# EasyEDA Pro project ProPrj_transverter-front-end_2026-04-14.epro, board 1-PCB_PCB_transverter-power-board
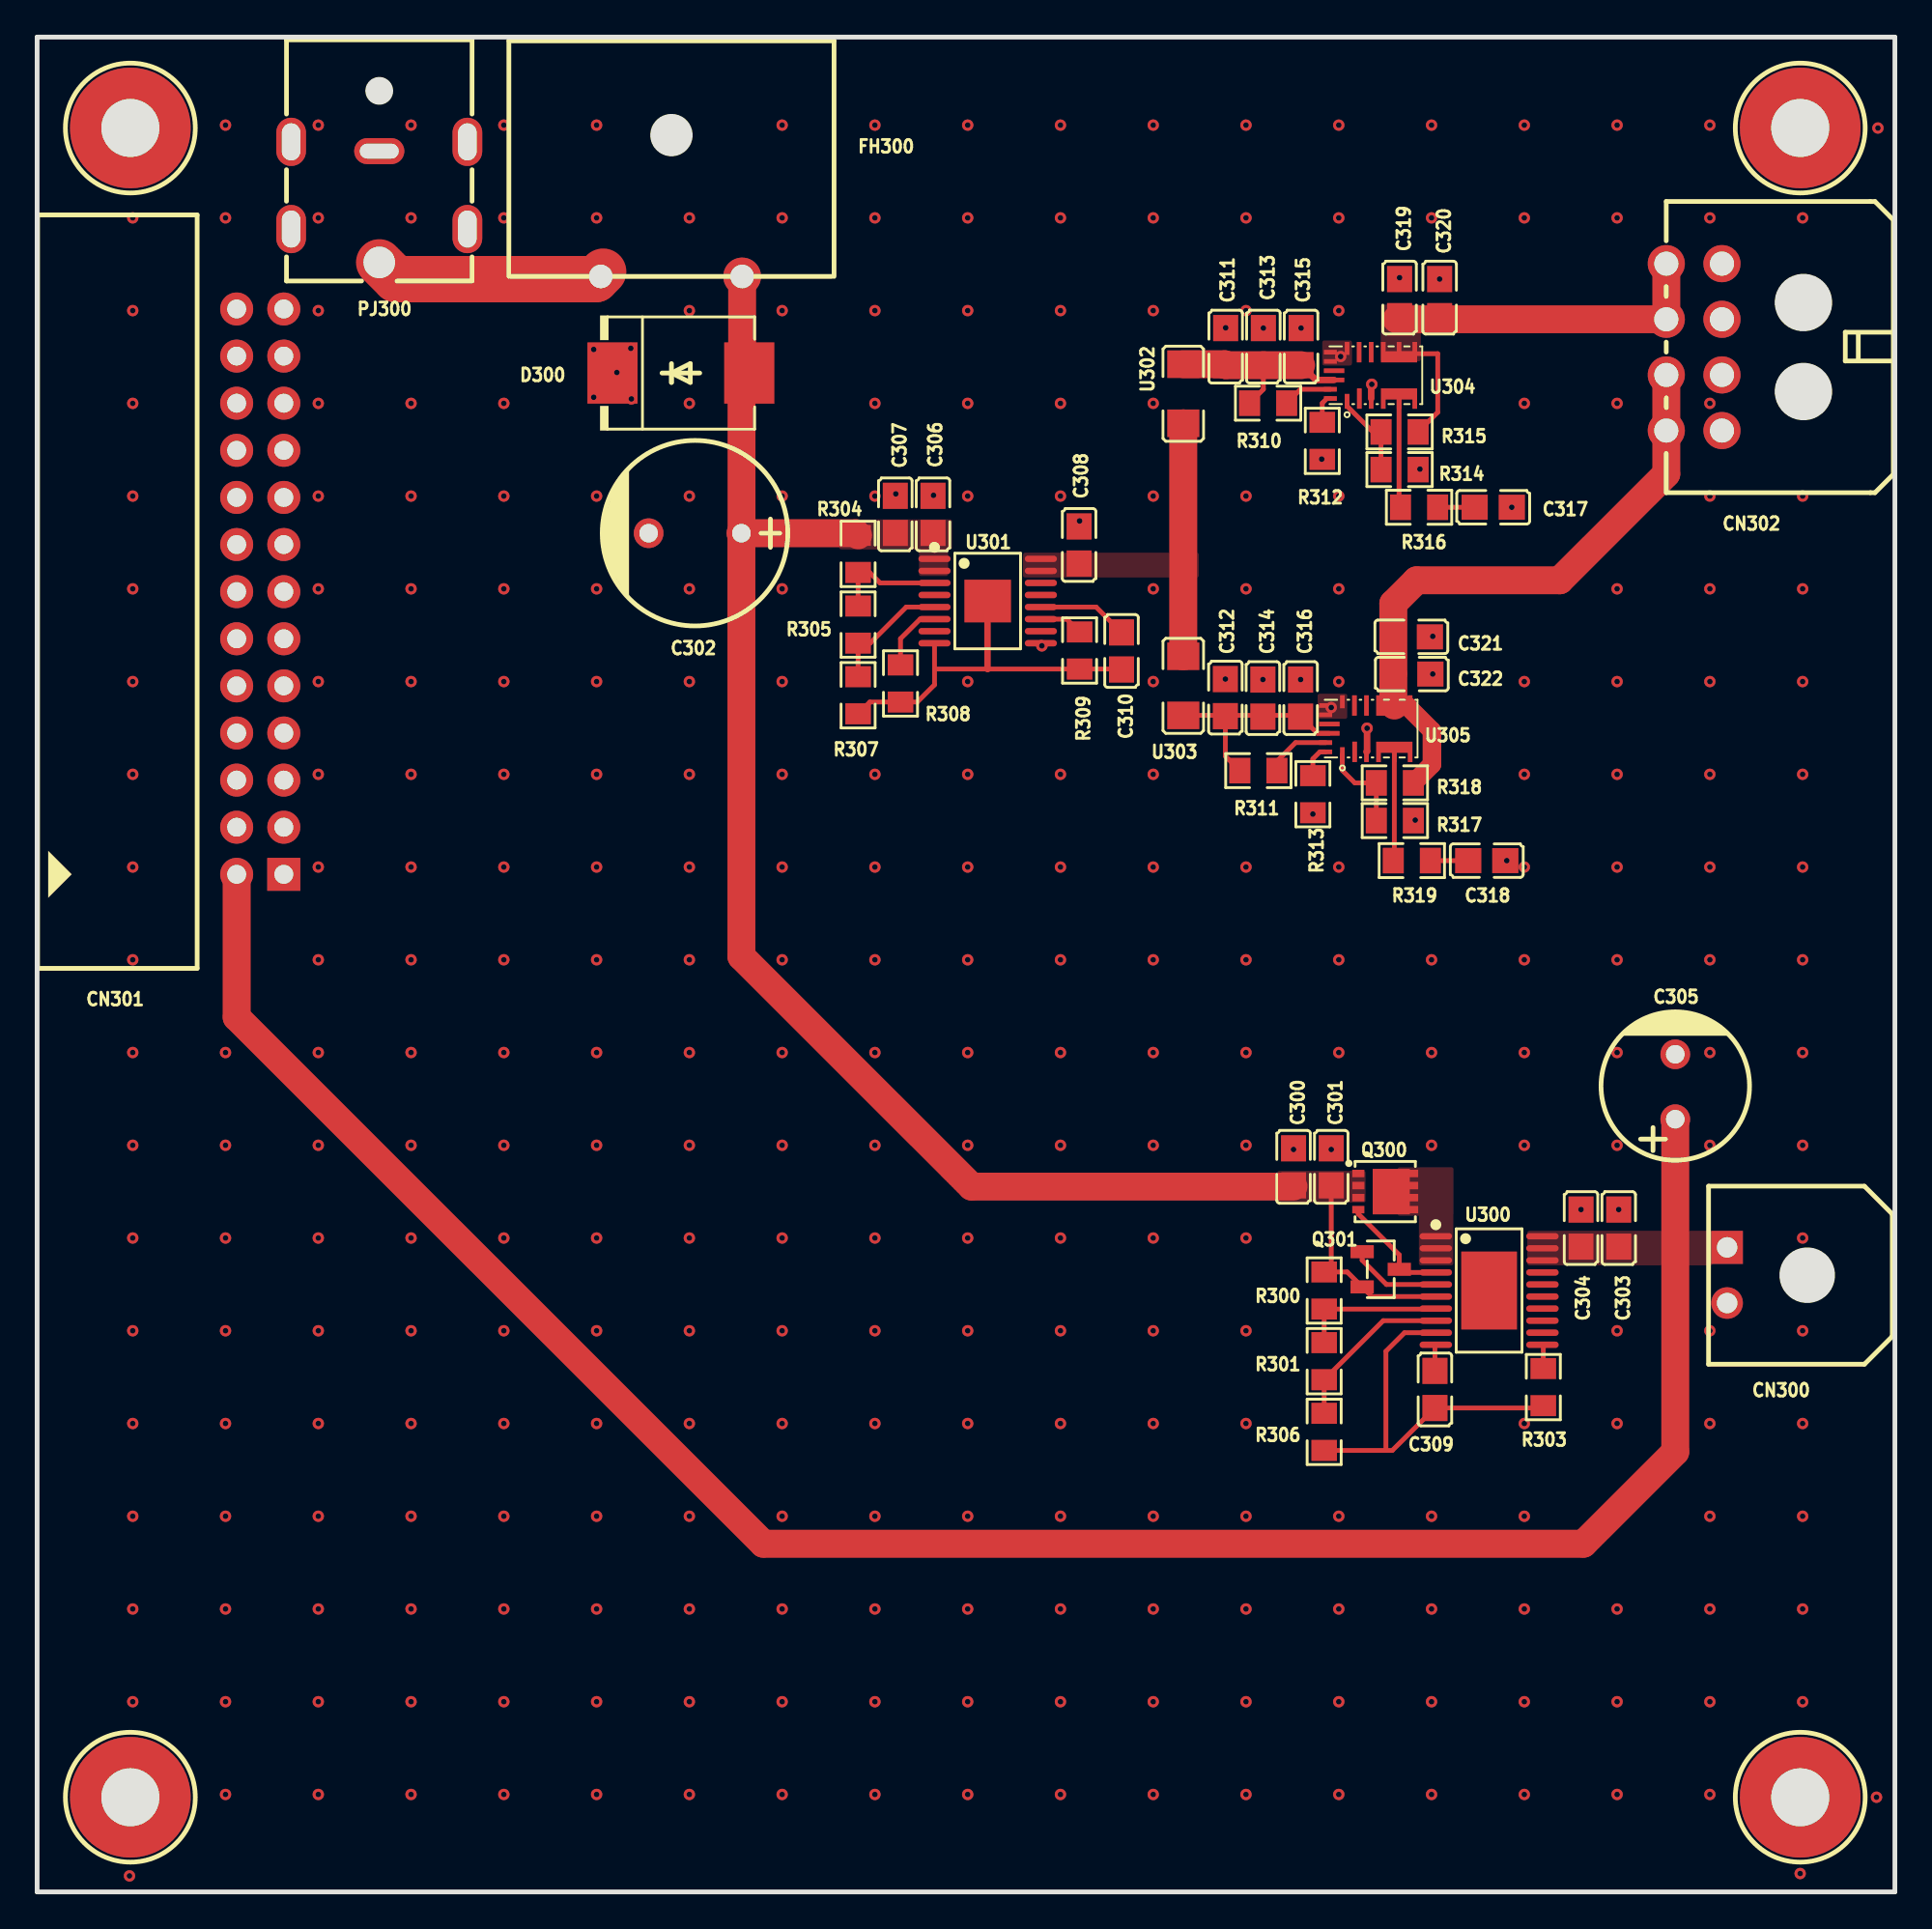
[diagram p9: board, top side]
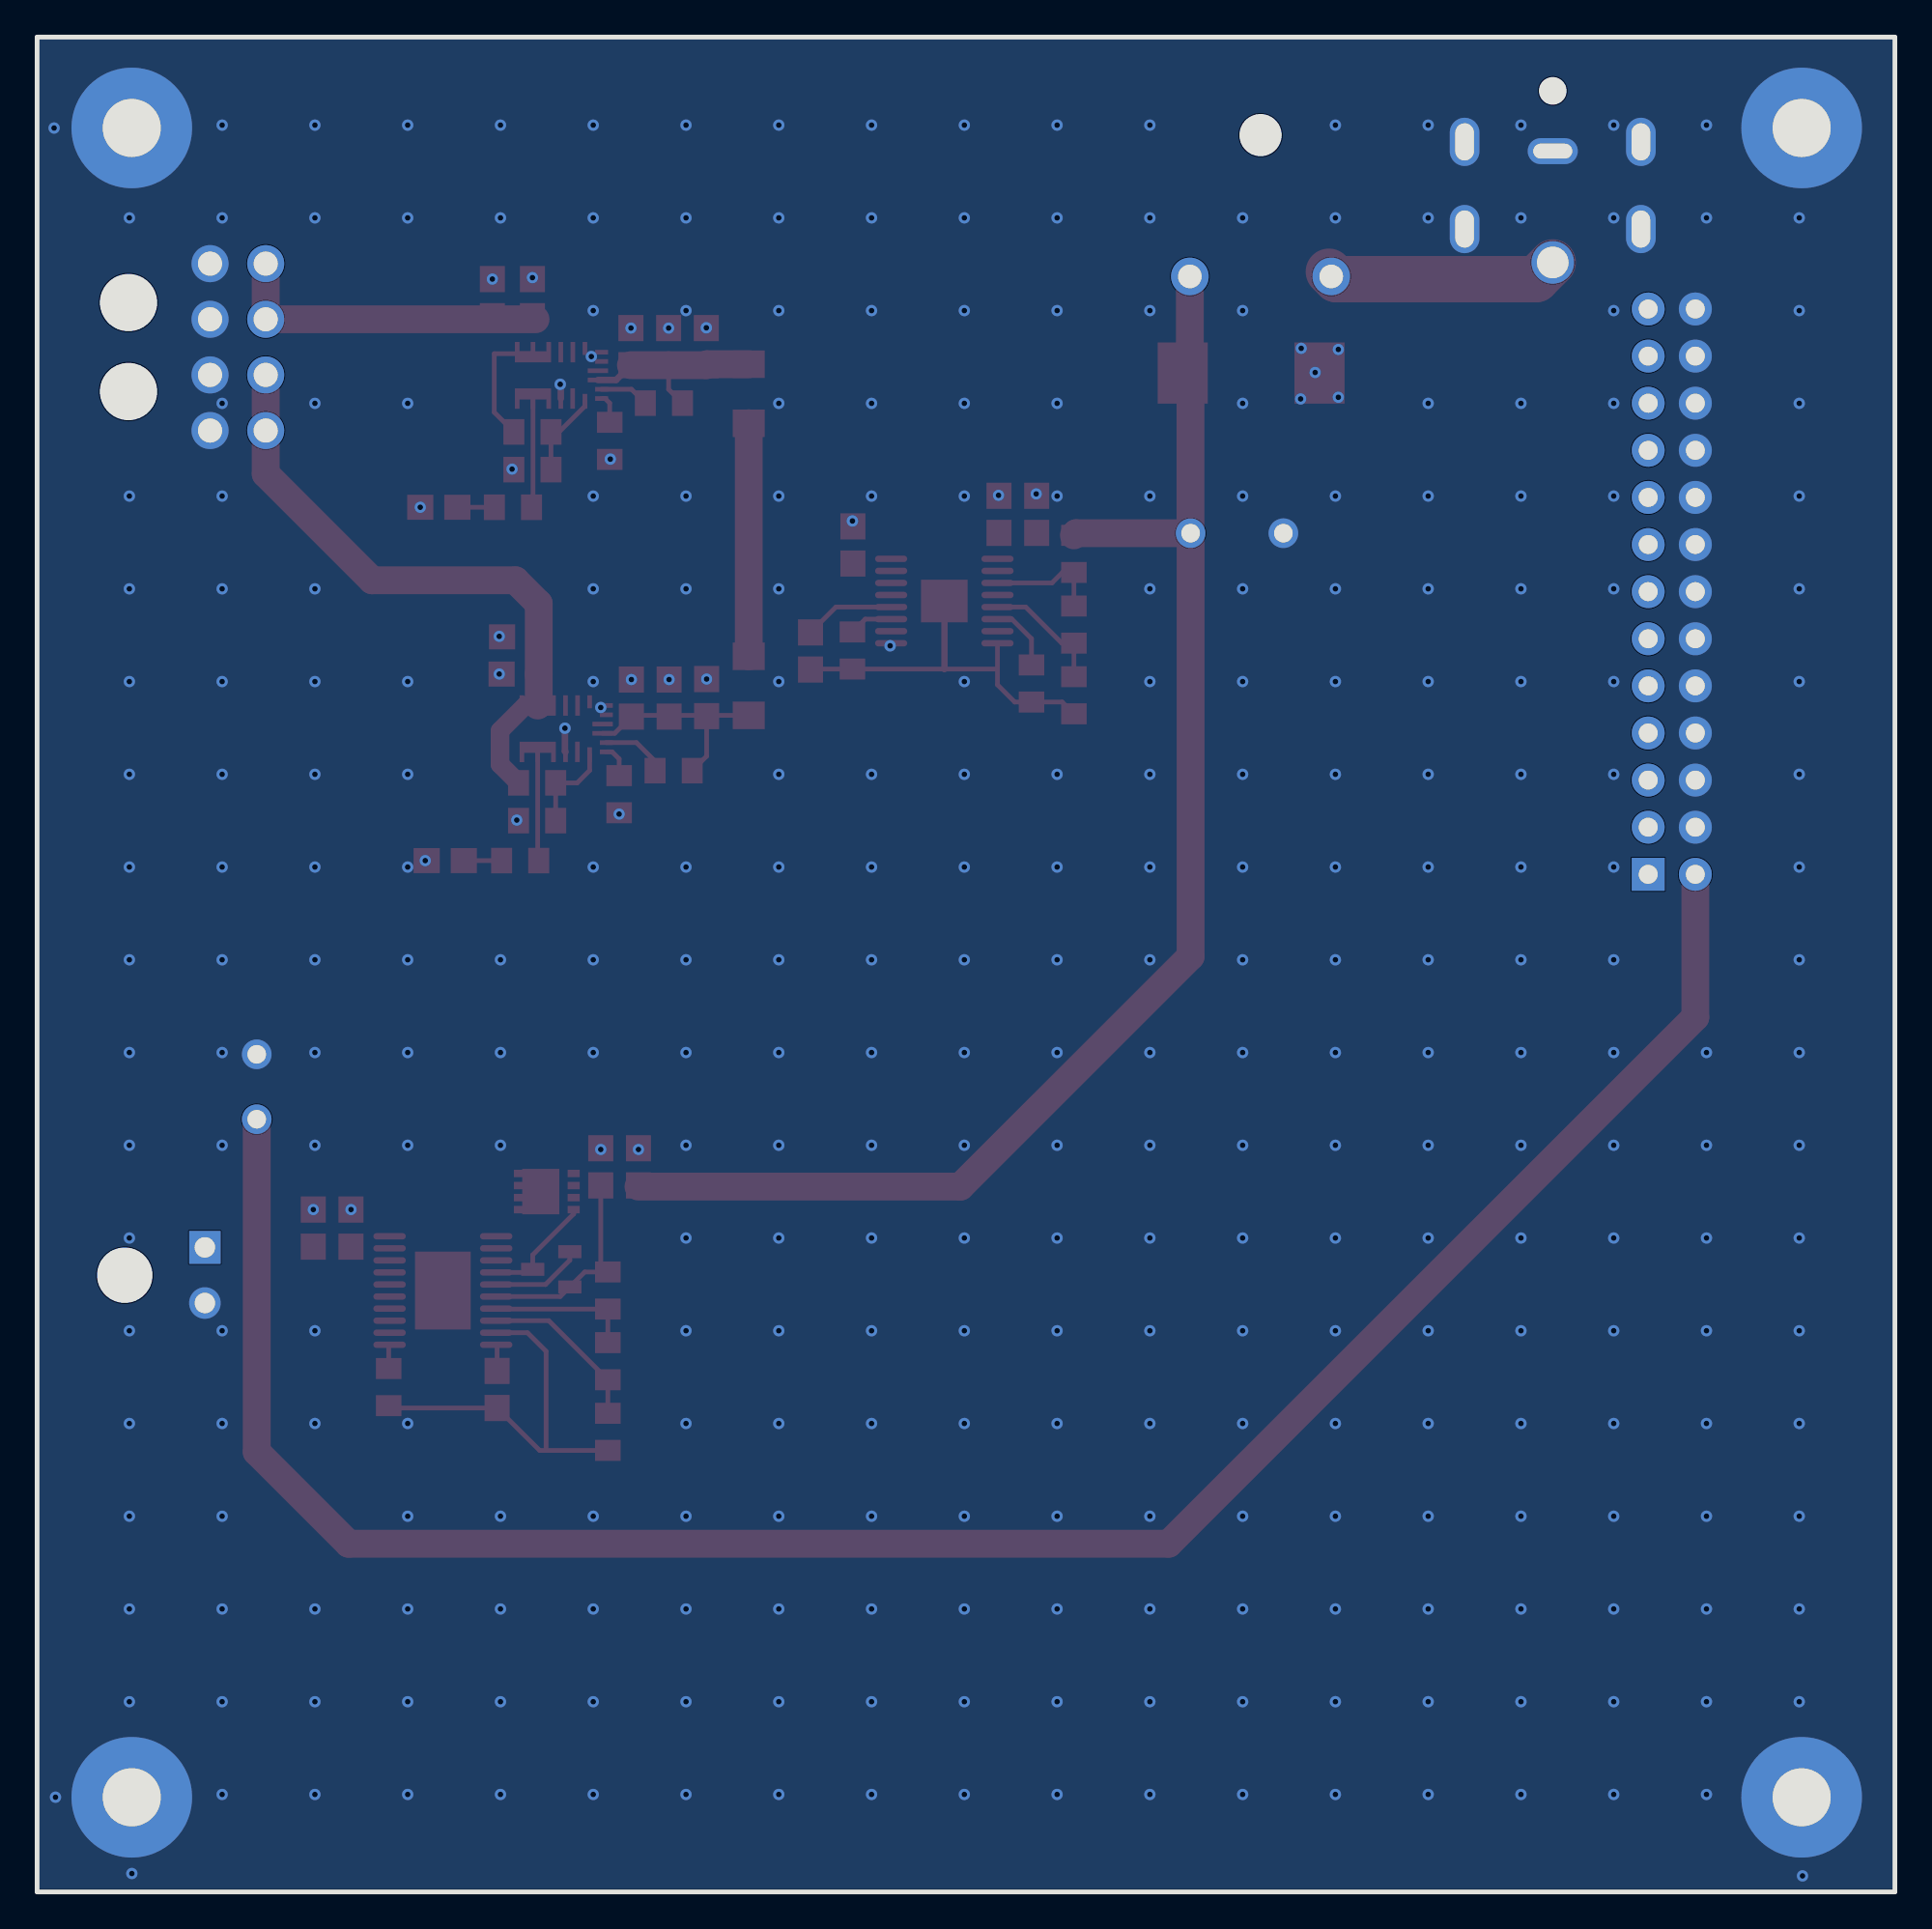
[diagram p10: board, bottom side, seen from below]

Outline 100.13 x 100 mm; copper layers: Top Layer, Bottom Layer. Coordinates in mm from the lower left corner of the outline.
Outline path: 0,100 100.13,100 100.13,0 0,0 0,100
Stack: Top Layer 0.035mm / Dielectric1 1.51mm FR4 er 4.5 / Bottom Layer 0.035mm

## Design rules (mm)
net BUCK-FEED: main_power
net PA-OUTPUT: main_power
template: User Custom Config
spacing Default (default): track to track 0.152, other pairs 0 to 0.152
spacing clean_voltage: track to track 0.152, other pairs 0.152 to 0.3
spacing control_lines: track to track 0.5, other pairs 0.152 to 0.3
spacing ground_guard: track to track 0.3, other pairs 0.152 to 0.3
spacing main_power: track to track 2, other pairs 0.152 to 0.3
spacing relay_power: track to track 1, other pairs 0.152 to 0.3
spacing RF: track to track 1, other pairs 0 to 0.65
spacing small_components: track to track 0.152, other pairs 0.152 to 0.3
spacing small_power: track to track 0.6, other pairs 0.152 to 0.3
track width Default (default): min 0.254, default 0.254, max 25.4
track width control_lines: min 0.25, default 0.25, max 0.26
track width main_power: min 1.5, default 1.5, max 3
track width relay_power: min 1, default 1, max 1.25
track width RF: min 0.157, default 0.157, max 0.157
track width small_power: min 0.5, default 0.5, max 2.54
differential pair differentialPair (default): width min 0.127, default 0.254, max 2.54; gap min 0.152, default 0.152
via Default (default): diameter min 0.61, default 0.61, max 100.025; hole min 0.305, default 0.305, max 59.995
via RF: diameter min 0.61, default 0.61, max 100.025; hole min 0.305, default 0.305, max 59.995
net $Q300_5 uses copper_pour_power_trace

## Placement (name value [footprint] x y rotation side)
C300  100nF  [C0805]  67.72 39.09 270 top
C301  1uF  [C0805]  69.75 39.09 90 top
C302  220µF  [CAP-TH_BD10.0-P5.00-D0.6-FD]  35.46 73.25 180 top
C303  100nF  [C0805]  85.24 35.79 90 top
C304  1uF  [C0805]  83.21 35.79 90 top
C305  47 µF  [CAP-TH_BD8.0-P3.50-D0.6-FD]  88.29 43.41 90 top
C306  100nF  [C0805]  48.29 74.27 90 top
C307  1uF  [C0805]  46.25 74.27 270 top
C308  1uF  [C0805]  56.16 72.62 270 top
C309  100nF  [C0805]  75.34 27.09 90 top
C310  100nF  [C0805]  58.45 66.9 90 top
C311  10uF  [C0805]  64.06 83.31 270 top
C312  10uF  [C0805]  64.04 64.39 270 top
C313  1uF  [C0805]  66.09 83.31 90 top
C314  1uF  [C0805]  66.07 64.36 90 top
C315  100nF  [C0805]  68.12 83.31 90 top
C316  100nF  [C0805]  68.1 64.36 90 top
C317  330pF  [C0805]  78.48 74.65 0 top
C318  330pF  [C0805]  78.13 55.6 0 top
C319  22uF  [C0805]  73.43 85.95 90 top
C320  22uF  [C0805]  75.59 85.95 90 top
C321  22uF  [C0805]  74.07 67.67 0 top
C322  22uF  [C0805]  74.09 65.66 0 top
CN300  2x1 connector  [CONN-TH_2P-P3.00_MOLEX_436500200]  91.08 33.25 90 top
CN301  SBH11-PBPC-D13-RA-BK  [IDC-TH_26P-P2.54-H-M-R2-C13-W8.8]  12.03 70.1 270 top
CN302  4x2 connector  [CONN-TH_0430450800]  89.31 83.29 90 top
D300  SMCJ18A_C374030  [SMC_L6.9-W5.9-LS7.9-RD]  34.7 81.89 0 top
FH300  -  [01530007Z]  34.19 87.1 180 top
NOREF  -  [Pad_e1507]  95.03 95.1 0 top
NOREF#2  -  [Pad_e1355]  5.03 95.1 0 top
NOREF#3  -  [Pad_e1509]  5.03 5.1 0 top
NOREF#4  -  [Pad_e1508]  95.03 5.1 0 top
PJ300  PJ-082BH  [AUDIO-TH_PJ-082BH]  18.44 91.1 270 top
Q300  CSD19537Q3  [DFN-8_L3.3-W3.3-P0.65-BL-3]  72.67 37.76 270 top
Q301  BSS138LT3G  [SOT-23-3_L2.9-W1.3-P1.90-LS2.4-BR]  72.42 33.57 180 top
R300  422k  [R0805]  69.37 32.42 90 top
R301  43.2k  [R0805]  69.37 28.61 90 top
R303  3.6k  [R0805]  81.18 27.22 270 top
R304  422k  [R0805]  44.25 72.14 90 top
R305  43.2k  [R0805]  44.25 68.33 90 top
R306  30.1k  [R0805]  69.37 24.8 90 top
R307  30.1k  [R0805]  44.25 64.52 90 top
R308  402k  [R0805]  46.53 65.15 270 top
R309  6.04k  [R0805]  56.19 66.93 270 top
R310  100k  [R0805]  66.34 80.26 180 top
R311  100k  [R0805]  65.82 60.45 180 top
R312  53.6k  [R0805]  69.27 78.23 90 top
R313  53.6k  [R0805]  68.76 59.18 90 top
R314  6.19k  [R0805]  73.43 76.68 180 top
R315  35.2k  [R0805]  73.43 78.71 180 top
R316  5.6  [R0805]  74.48 74.65 0 top
R317  6.49k  [R0805]  73.18 57.76 180 top
R318  34k  [R0805]  73.18 59.79 180 top
R319  5.6  [R0805]  74.09 55.6 0 top
U300  TPS26631PWPR  [HTSSOP-20_L6.5-W4.4-P0.65-LS6.4-BL-EP]  78.26 32.42 270 top
U301  TPS26600PWPR  [HTSSOP-16_L5.0-W4.4-P0.65-LS6.4-BL-EP2.5]  51.23 69.6 270 top
U302  BLM31PG601SH1L  [L1206]  61.77 80.77 90 top
U303  BLM31PG601SH1L  [L1206]  61.77 65.02 270 top
U304  MPM3610GQV-Z  [QFN-20_L5.0-W3.0-TL-MPM3610GQV-Z]  71.55 81.79 90 top
U305  MPM3610GQV-Z  [QFN-20_L5.0-W3.0-TL-MPM3610GQV-Z]  71.3 62.74 90 top

## Footprints (pads in the part's own frame, mm; a bottom-side part is the same pattern mirrored in y, then rotated)
01530007Z
  round 2.032 hole 1.27: 1(-3.81,0) 2(3.81,0)
AUDIO-TH_PJ-082BH
  round 2.3 hole 1.7: 1(3.25,0)
  oval 1.4x2.7 hole 0.8x2.1: 2(-2.75,0)
  oval 2.6x1.6 hole 2x1: 3(1.45,-4.75) 4(-3.25,-4.75) 5(1.45,4.75) 6(-3.25,4.75)
C0805
  rect 1.41x1.35 smd: 1(-1,0) 2(1,0)
CAP-TH_BD8.0-P3.50-D0.6-FD
  round 1.6 hole 1: 1(-1.75,0) 2(1.75,0)
CAP-TH_BD10.0-P5.00-D0.6-FD
  round 1.6 hole 1: 1(-2.5,0) 2(2.5,0)
CONN-TH_2P-P3.00_MOLEX_436500200
  rect 1.778x1.7 hole 1.1: 1(1.5,0)
  round 1.7 hole 1.1: 2(-1.5,0)
CONN-TH_0430450800
  round 2 hole 1.3: 1(4.5,-1.5) 2(1.5,-1.5) 3(-1.5,-1.5) 4(-4.5,-1.5) 5(4.5,1.5) 6(1.5,1.5) 7(-1.5,1.5) 8(-4.5,1.5)
DFN-8_L3.3-W3.3-P0.65-BL-3
  rect 0.4x0.65 smd: 1(-0.975,-1.462) 2(-0.325,-1.462) 3(0.325,-1.462) 4(0.975,-1.462)
  rect 0.4x0.6 smd: 5(0.975,1.462) 6(0.325,1.462) 7(-0.325,1.462) 8(-0.975,1.462)
  rect 2.45x2 smd: 9(0,0.312)
HTSSOP-16_L5.0-W4.4-P0.65-LS6.4-BL-EP2.5
  oval 0.343x1.732 smd: 1(-2.275,-2.866) 2(-1.625,-2.866) 3(-0.975,-2.866) 4(-0.325,-2.866) 5(0.325,-2.866) 6(0.975,-2.866) 7(1.625,-2.866) 8(2.275,-2.866) 9(2.275,2.866) 10(1.625,2.866) 11(0.975,2.866) 12(0.325,2.866) 13(-0.325,2.866) 14(-0.975,2.866) 15(-1.625,2.866) 16(-2.275,2.866)
  rect 2.3x2.51 smd: 17(0,0.001)
HTSSOP-20_L6.5-W4.4-P0.65-LS6.4-BL-EP
  oval 0.343x1.746 smd: 1(-2.925,-2.873) 2(-2.275,-2.873) 3(-1.625,-2.873) 4(-0.975,-2.873) 5(-0.325,-2.873) 6(0.325,-2.873) 7(0.975,-2.873) 8(1.625,-2.873) 9(2.275,-2.873) 10(2.925,-2.873) 11(2.925,2.873) 12(2.275,2.873) 13(1.625,2.873) 14(0.975,2.873) 15(0.325,2.873) 16(-0.325,2.873) 17(-0.975,2.873) 18(-1.625,2.873) 19(-2.275,2.873) 20(-2.925,2.873)
  rect 4.2x3 smd: 21(0,0)
IDC-TH_26P-P2.54-H-M-R2-C13-W8.8
  rect 1.778x1.778 hole 1.02: 1(15.24,1.27)
  round 1.778 hole 1.02: 2(15.24,-1.27) 3(12.7,1.27) 4(12.7,-1.27) 5(10.16,1.27) 6(10.16,-1.27) 7(7.62,1.27) 8(7.62,-1.27) 9(5.08,1.27) 10(5.08,-1.27) 11(2.54,1.27) 12(2.54,-1.27) 13(0,1.27) 14(0,-1.27) 15(-2.54,1.27) 16(-2.54,-1.27) 17(-5.08,1.27) 18(-5.08,-1.27) 19(-7.62,1.27) 20(-7.62,-1.27) 21(-10.16,1.27) 22(-10.16,-1.27) 23(-12.7,1.27) 24(-12.7,-1.27) 25(-15.24,1.27) 26(-15.24,-1.27)
L1206
  rect 1.485x1.728 smd: 1(-1.593,0) 2(1.593,0)
Pad_e1355
  round 6.5 hole 3.125: 1(0,0)
Pad_e1507
  round 6.5 hole 3.125: 1(0,0)
Pad_e1508
  round 6.5 hole 3.125: 1(0,0)
Pad_e1509
  round 6.5 hole 3.125: 1(0,0)
QFN-20_L5.0-W3.0-TL-MPM3610GQV-Z
  rect 0.8x0.25 smd: 1(-1.425,0.95)
  rect 1.1x0.25 smd: 2(-1.275,0.289) 3(-1.275,-0.35) 10(1.225,-0.35) 11(1.225,0.3)
  custom 1.1x1.95 smd: 4(-1.276,-1.85) 9(1.225,-1.85)
  rect 0.7x0.25 smd: 12(1.425,0.95)
  rect 0.25x0.7 smd: 13(1.225,1.85) 14(0.725,1.85) 17(-0.775,1.85) 18(-1.275,1.85)
  rect 0.25x1.1 smd: 15(0.225,1.65) 16(-0.275,1.65)
R0805
  rect 1.133x1.377 smd: 1(-1,0) 2(1,0)
SMC_L6.9-W5.9-LS7.9-RD
  rect 2.7x3.3 smd: 1(-3.687,0) 2(3.687,0)
SOT-23-3_L2.9-W1.3-P1.90-LS2.4-BR
  rect 1.25x0.7 smd: 1(1,-0.95) 2(1,0.95) 3(-1,0)

## Nets
As in the schematic, except:
GND: C300.1 C301.2 C302.2 C303.2 C304.2 C305.2 C306.2 C307.1 C308.1 C311.1 C312.1 C313.2 C314.2 C315.2 C316.2 C317.2 C318.2 C319.2 C320.2 C321.2 C322.2 CN300.2 CN301.4 CN301.6 CN301.8 CN301.10 CN301.12 CN301.14 CN301.16 CN301.18 CN301.20 CN301.22 CN301.24 CN301.26 CN302.1 CN302.2 CN302.3 CN302.4 D300.1 NOREF.1 NOREF#2.1 NOREF#3.1 NOREF#4.1 PJ300.2 PJ300.3 PJ300.4 PJ300.5 PJ300.6 R312.1 R313.1 R314.1 R317.1 U300.21 U301.9 U304.3 U304.12 U304.13 U304.14 U305.3 U305.12 U305.13 U305.14
$C309_1: C309.1 R303.2 R306.1 U300.9

Pads without a net: CN301 1 3 5 7 9 11 13 15 17 19 21 23 25; U300 13 14 15 16 17; U301 4 7 10 13 14; U304 2 10 11 15; U305 2 10 11 15

## Via types
v1: diameter 0.61, hole 0.305, Top Layer to Bottom Layer, 337 vias
v2: diameter 0.62, hole 0.31, Top Layer to Bottom Layer, 6 vias

## Routing (per net, layer and track width the routed paths; a pad name or vN(x,y) marks a point on that pad's centre or on a via; arc(x,y) is an arc through that point)
GND: length 2.3
  Top Layer w0.35: U305.3 71.68,61.49 v2(71.68,62.74) ; U301.9 54.15,67.27 v2(54.15,67.18) ; U304.3 71.9,81.25 v2(71.93,81.28) ; R312.1 69.23,77.2
  vias: v1(4.98,0.86) v1(5.15,90.25) v1(5.15,85.25) v1(5.15,80.25) v1(5.15,75.25) v1(5.15,70.25) v1(5.15,65.25) v1(5.15,60.25) v1(5.15,55.25) v1(5.15,50.25) v1(5.15,45.25) v1(5.15,40.25) v1(5.15,35.25) v1(5.15,30.25) v1(5.15,25.25) v1(5.15,20.25) v1(5.15,15.25) v1(5.15,10.25) v1(10.15,95.25) v1(10.15,90.25) v1(10.15,45.25) v1(10.15,40.25) v1(10.15,35.25) v1(10.15,30.25) v1(10.15,25.25) v1(10.15,20.25) v1(10.15,15.25) v1(10.15,10.25) v1(10.15,5.25) v1(15.15,95.25) v1(15.15,90.25) v1(15.15,85.25) v1(15.15,80.25) v1(15.15,75.25) v1(15.15,70.25) v1(15.15,65.25) v1(15.15,60.25) v1(15.15,55.25) v1(15.15,50.25) v1(15.15,45.25) v1(15.15,40.25) v1(15.15,35.25) v1(15.15,30.25) v1(15.15,25.25) v1(15.15,20.25) v1(15.15,15.25) v1(15.15,10.25) v1(15.15,5.25) v1(20.15,95.25) v1(20.15,90.25) v1(20.15,80.25) v1(20.15,75.25) v1(20.15,70.25) v1(20.15,65.25) v1(20.15,60.25) v1(20.15,55.25) v1(20.15,50.25) v1(20.15,45.25) v1(20.15,40.25) v1(20.15,35.25) v1(20.15,30.25) v1(20.15,25.25) v1(20.15,20.25) v1(20.15,15.25) v1(20.15,10.25) v1(20.15,5.25) v1(25.15,95.25) v1(25.15,90.25) v1(25.15,80.25) v1(25.15,75.25) v1(25.15,70.25) v1(25.15,65.25) v1(25.15,60.25) v1(25.15,55.25) v1(25.15,50.25) v1(25.15,45.25) v1(25.15,40.25) v1(25.15,35.25) v1(25.15,30.25) v1(25.15,25.25) v1(25.15,20.25) v1(25.15,15.25) v1(25.15,10.25) v1(25.15,5.25) v1(30,83.16) v1(30,80.58) v1(30.15,95.25) v1(30.15,90.25) v1(30.15,75.25) v1(30.15,70.25) v1(30.15,65.25) v1(30.15,60.25) v1(30.15,55.25) v1(30.15,50.25) v1(30.15,45.25) v1(30.15,40.25) v1(30.15,35.25) v1(30.15,30.25) v1(30.15,25.25) v1(30.15,20.25) v1(30.15,15.25) v1(30.15,10.25) v1(30.15,5.25) v1(31.25,81.92) v1(32,83.22) v1(32.03,80.49) v1(35.15,90.25) v1(35.15,85.25) v1(35.15,80.25) v1(35.15,75.25) v1(35.15,70.25) v1(35.15,65.25) v1(35.15,60.25) v1(35.15,55.25) v1(35.15,50.25) v1(35.15,45.25) v1(35.15,40.25) v1(35.15,35.25) v1(35.15,30.25) v1(35.15,25.25) v1(35.15,20.25) v1(35.15,15.25) v1(35.15,10.25) v1(35.15,5.25) v1(40.15,95.25) v1(40.15,90.25) v1(40.15,85.25) v1(40.15,75.25) v1(40.15,70.25) v1(40.15,65.25) v1(40.15,60.25) v1(40.15,55.25) v1(40.15,50.25) v1(40.15,45.25) v1(40.15,40.25) v1(40.15,35.25) v1(40.15,30.25) v1(40.15,25.25) v1(40.15,20.25) v1(40.15,15.25) v1(40.15,10.25) v1(40.15,5.25) v1(45.15,95.25) v1(45.15,90.25) v1(45.15,85.25) v1(45.15,80.25) v1(45.15,75.25) v1(45.15,60.25) v1(45.15,55.25) v1(45.15,50.25) v1(45.15,45.25) v1(45.15,40.25) v1(45.15,35.25) v1(45.15,30.25) v1(45.15,25.25) v1(45.15,20.25) v1(45.15,15.25) v1(45.15,10.25) v1(45.15,5.25) v1(46.28,75.37) v1(48.31,75.29) v1(50.15,95.25) v1(50.15,90.25) v1(50.15,85.25) v1(50.15,80.25) v1(50.15,75.25) v1(50.15,65.25) v1(50.15,60.25) v1(50.15,55.25) v1(50.15,50.25) v1(50.15,45.25) v1(50.15,40.25) v1(50.15,35.25) v1(50.15,30.25) v1(50.15,25.25) v1(50.15,20.25) v1(50.15,15.25) v1(50.15,10.25) v1(50.15,5.25) v1(55.15,95.25) v1(55.15,90.25) v1(55.15,85.25) v1(55.15,80.25) v1(55.15,75.25) v1(55.15,60.25) v1(55.15,55.25) v1(55.15,50.25) v1(55.15,45.25) v1(55.15,40.25) v1(55.15,35.25) v1(55.15,30.25) v1(55.15,25.25) v1(55.15,20.25) v1(55.15,15.25) v1(55.15,10.25) v1(55.15,5.25) v1(60.15,95.25) v1(60.15,90.25) v1(60.15,85.25) v1(60.15,80.25) v1(60.15,75.25) v1(60.15,70.25) v1(60.15,65.25) v1(60.15,60.25) v1(60.15,55.25) v1(60.15,50.25) v1(60.15,45.25) v1(60.15,40.25) v1(60.15,35.25) v1(60.15,30.25) v1(60.15,25.25) v1(60.15,20.25) v1(60.15,15.25) v1(60.15,10.25) v1(60.15,5.25) v1(64.04,65.39) v1(65.15,95.25) v1(65.15,90.25) v1(65.15,85.25) v1(65.15,75.25) v1(65.15,70.25) v1(65.15,55.25) v1(65.15,50.25) v1(65.15,45.25) v1(65.15,40.25) v1(65.15,35.25) v1(65.15,30.25) v1(65.15,25.25) v1(65.15,20.25) v1(65.15,15.25) v1(65.15,10.25) v1(65.15,5.25) v1(66.07,65.36) v1(66.09,84.31) v1(67.72,40.03) v1(68.12,84.31) v1(68.1,65.36) v1(68.76,58.11) v1(69.75,63.86) v1(69.75,40.03) v1(70.15,95.25) v1(70.15,90.25) v1(70.15,85.25) v1(70.15,75.25) v1(70.15,70.25) v1(70.15,65.25) v1(70.15,55.25) v1(70.15,50.25) v1(70.15,45.25) v1(70.15,20.25) v1(70.15,15.25) v1(70.15,10.25) v1(70.15,5.25) v1(70.26,82.78) v1(73.43,87.03) v1(74.28,57.78) v1(74.53,76.71) v1(75.15,95.25) v1(75.15,90.25) v1(75.15,50.25) v1(75.15,45.25) v1(75.15,40.25) v1(75.15,20.25) v1(75.15,15.25) v1(75.15,10.25) v1(75.15,5.25) v1(75.22,67.69) v1(75.22,65.66) v1(75.59,86.95) v1(79.21,55.6) v1(79.48,74.65) v1(80.15,95.25) v1(80.15,90.25) v1(80.15,80.25) v1(80.15,65.25) v1(80.15,60.25) v1(80.15,55.25) v1(80.15,50.25) v1(80.15,45.25) v1(80.15,40.25) v1(80.15,25.25) v1(80.15,20.25) v1(80.15,15.25) v1(80.15,10.25) v1(80.15,5.25) v1(83.21,36.79) v1(85.15,95.25) v1(85.15,90.25) v1(85.15,80.25) v1(85.15,70.25) v1(85.15,65.25) v1(85.15,60.25) v1(85.15,55.25) v1(85.15,50.25) v1(85.15,45.25) v1(85.15,40.25) v1(85.15,30.25) v1(85.15,25.25) v1(85.15,15.25) v1(85.15,10.25) v1(85.15,5.25) v1(85.24,36.79) v1(90.15,95.25) v1(90.15,90.25) v1(90.15,80.25) v1(90.15,75.25) v1(90.15,70.25) v1(90.15,65.25) v1(90.15,60.25) v1(90.15,55.25) v1(90.15,50.25) v1(90.15,45.25) v1(90.15,40.25) v1(90.15,30.25) v1(90.15,25.25) v1(90.15,20.25) v1(90.15,15.25) v1(90.15,10.25) v1(90.15,5.25) v1(95.02,0.99) v1(95.15,90.25) v1(95.15,75.25) v1(95.15,70.25) v1(95.15,65.25) v1(95.15,60.25) v1(95.15,55.25) v1(95.15,50.25) v1(95.15,45.25) v1(95.15,40.25) v1(95.15,35.25) v1(95.15,30.25) v1(95.15,25.25) v1(95.15,20.25) v1(95.15,15.25) v1(95.15,10.25) v1(99.14,5.11) v1(99.21,95.1) v2(56.19,73.91) v2(64.06,84.33) v2(69.23,77.25)
$C309_1: length 21.3
  Top Layer w0.254: R303.2 81.05,26.09 C309.1 73.04,23.8 72.69,23.8 ; U300.9 73.7,30.15 72.69,29.15 72.69,23.8 ; 72.69,23.8 69.37,23.8
$C309_2: length 1.4
  Top Layer w0.254: 75.38,29.5 75.34,29.45 C309.2
$C310_1: length 20.6
  Top Layer w0.254: 48.37,65.93 48.37,65.08 47.44,64.15 46.53,64.15 ; 48.37,65.93 51.23,65.93 ; 48.37,65.93 48.37,67.32 ; 58.34,65.93 R309.2 ; R307.1 44.88,64.15 R308.2 ; 56.19,65.93 51.29,65.93
  Top Layer w0.342: 51.23,69.6 51.22,69.59 51.22,65.94 51.23,65.93
$C310_2: length 4.9
  Top Layer w0.254: C310.2 57.08,69.27 U301.12
$C311_2: length 10.8
  Top Layer w0.254: C313.1 66.09,81.01 R310.2
  Top Layer w0.35: C315.1 68.92,81.51 U304.16
  Top Layer w1.5: U302.2 64.01,82.36 C311.2 C313.1 C315.1
$C312_2: length 11.5
  Top Layer w0.254: U305.16 69,62.46 C316.1 68.03,63.43 U303.2 ; C312.2 64.04,61.23 R311.2
$C317_1: length 2
  Top Layer w0.254: R316.2 C317.1
$C318_1: length 2
  Top Layer w0.254: R319.2 C318.1
$FH300_2: length 12.6
  Top Layer w2.5: 30.51,87.35 30.1,86.95 19.34,86.95 PJ300.1
$Q300_4: length 6.2
  Top Layer w0.254: 71.21,36.78 71.21,36.55 73.42,34.34 Q301.3 73.58,33.4 75.38,33.4
$Q301_1: length 5
  Top Layer w0.254: Q301.1 71.42,34.06 72.73,32.75 75.38,32.75
$R300_1: length 7.8
  Top Layer w0.254: R301.2 R300.1 75.36,31.42 75.38,31.45
$R301_1: length 9.1
  Top Layer w0.254: U300.8 72.55,30.8 R301.1 R306.2
$R303_1: length 1.3
  Top Layer w0.254: 81.18,28.22 81.18,29.45 U300.11
$R304_1: length 6.2
  Top Layer w0.254: R305.2 R304.1 44.87,71.13 45.43,70.57 48.37,70.57
$R305_1: length 6.7
  Top Layer w0.254: 48.37,69.27 46.84,69.27 44.9,67.33 R305.1 R307.2
$R308_1: length 3.7
  Top Layer w0.254: R308.1 46.53,67.56 47.59,68.62 48.37,68.62
$R309_1: length 2.4
  Top Layer w0.254: U301.11 55.49,68.62 R309.1
$R310_1: length 2.7
  Top Layer w0.254: R310.1 68.09,81.01 U304.17
$R311_1: length 3
  Top Layer w0.254: U305.17 67.82,61.96 66.82,60.96
$R312_2: length 1.6
  Top Layer w0.254: 69.27,79.23 69.27,80.26 69.51,80.51 69.7,80.51
$R313_2: length 1.8
  Top Layer w0.254: U305.18 69.13,61.46 68.76,61.09 R313.2
$R314_2: length 4.7
  Top Layer w0.254: R314.2 R315.2 71.99,78.71 70.6,80.1 U304.1
$R316_1: length 5.9
  Top Layer w0.254: R316.1 73.4,74.73 U304.4
$R317_2: length 5
  Top Layer w0.254: R317.2 R318.2 71.02,59.79 70.35,60.46 U305.1
$R319_1: length 5.9
  Top Layer w0.254: 73.22,55.6 73.15,55.67 U305.4
BUCK-FEED: length 12.6
  Top Layer w1.5: U303.1 U302.1
FUSED-12V: length 89.6
  Top Layer w0.254: 69.75,38.03 69.75,33.8 R300.2 70.61,33.42 Q301.2 71.93,32.1 75.38,32.1
  Top Layer w1.5: C302.1 37.96,50.43 50.36,38.03 67.72,38.03 ; C302.1 37.97,73.26 37.97,81.47 D300.2 38,82.27 FH300.1 ; C302.1 44.13,73.25 R304.2
NOISY-5.3V: length 24.3
  Top Layer w0.254: U304.9 73.48,82.93 75.49,82.93 75.49,79.77 R315.1
  Top Layer w1.5: CN302.5 CN302.6 73.26,84.79
NOISY-5V: length 34.3
  Top Layer w1: U305.9 73.82,63.96 75.18,62.6 75.18,60.79 R318.1
  Top Layer w1.5: U305.9 73.09,64.02 C322.1 73.09,69.46 74.35,70.71 82.07,70.71 87.81,76.45 CN302.8 CN302.7
PA-OUTPUT: length 117
  Top Layer w1.5: CN301.2 10.76,47.16 39.14,18.77 83.34,18.77 88.29,23.72 C305.1

## Copper pours and planes (outline as drawn; the poured copper is in the pictures)
GND on Top Layer: 69.11,64.49 70.51,64.49 70.51,63.35 69.11,63.35
GND on Top Layer: 69.37,83.54 70.76,83.54 70.76,82.4 69.37,82.4
GND on Bottom Layer: 0.05,0.25 0.05,100.33 100.13,100.2 100.13,0.25
$Q300_5 on Top Layer: 74.57,38.96 76.23,38.96 76.23,33.88 74.57,33.88
$Q300_5 on Top Layer: 73.43,38.96 76.23,38.96 76.23,36.55 73.43,36.55
BUCK-FEED on Top Layer: 53.24,72.1 62.51,72.1 62.51,70.97 53.24,70.97
FUSED-12V on Top Layer: 66.93,38.77 71.5,38.77 71.5,37.27 66.93,37.27
FUSED-12V on Top Layer: 43.33,73.9 49.21,73.9 49.21,72.48 43.33,72.48
FUSED-12V on Top Layer: 47.63,72.64 49,72.64 49,71.04 47.63,71.04
NOISY-5.3V on Top Layer: 72.42,85.57 74.57,85.57 74.57,82.52 72.42,82.52
PA-OUTPUT on Top Layer: 80.42,35.53 92.04,35.53 92.04,33.88 80.42,33.88
